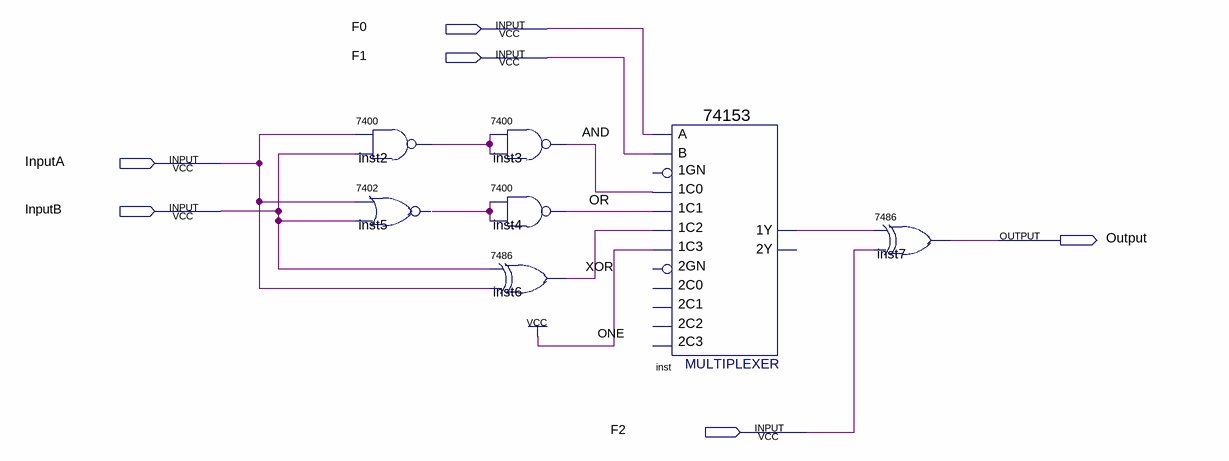
[diagram p0: schematic sheet]
// Quartus schematic ComputationUnit.bdf as structural Verilog: 7 symbols, 6 pins
module ComputationUnit (
  input  F0,
  input  F1,
  input  InputA,
  input  InputB,
  input  F2,
  output Output
);

  wire AND, inst2_1, inst5_1, inst_1y, OR, XOR;

  \7400  inst2 (.\3 (InputB), .\2 (InputA), .\1 (inst2_1));
  \7402  inst5 (.\2 (InputA), .\3 (InputB), .\1 (inst5_1));
  \7400  inst3 (.\3 (inst2_1), .\2 (inst2_1), .\1 (AND));
  \7400  inst4 (.\3 (inst5_1), .\2 (inst5_1), .\1 (OR));
  \7486  inst6 (.\2 (InputB), .\3 (InputA), .\1 (XOR));
  \74153  inst (
    .\1C1 (OR), .\1C0 (AND), .\1C2 (XOR), .\1C3 (1'b1), .B(F1), .A(F0), .\1Y (inst_1y));  // open: 1GN, 2C0, 2GN, 2C2, 2C1, 2C3, 2Y
  \7486  inst7 (.\2 (inst_1y), .\3 (F2), .\1 (Output));
endmodule
